# Altium schematic sheet 02_Connectors.SchDoc: Connectors
size A; Revision: A; SheetNumber: 2; SheetTotal: 10; ECE315_Project_Name: ECE453 Processor Mezzanine
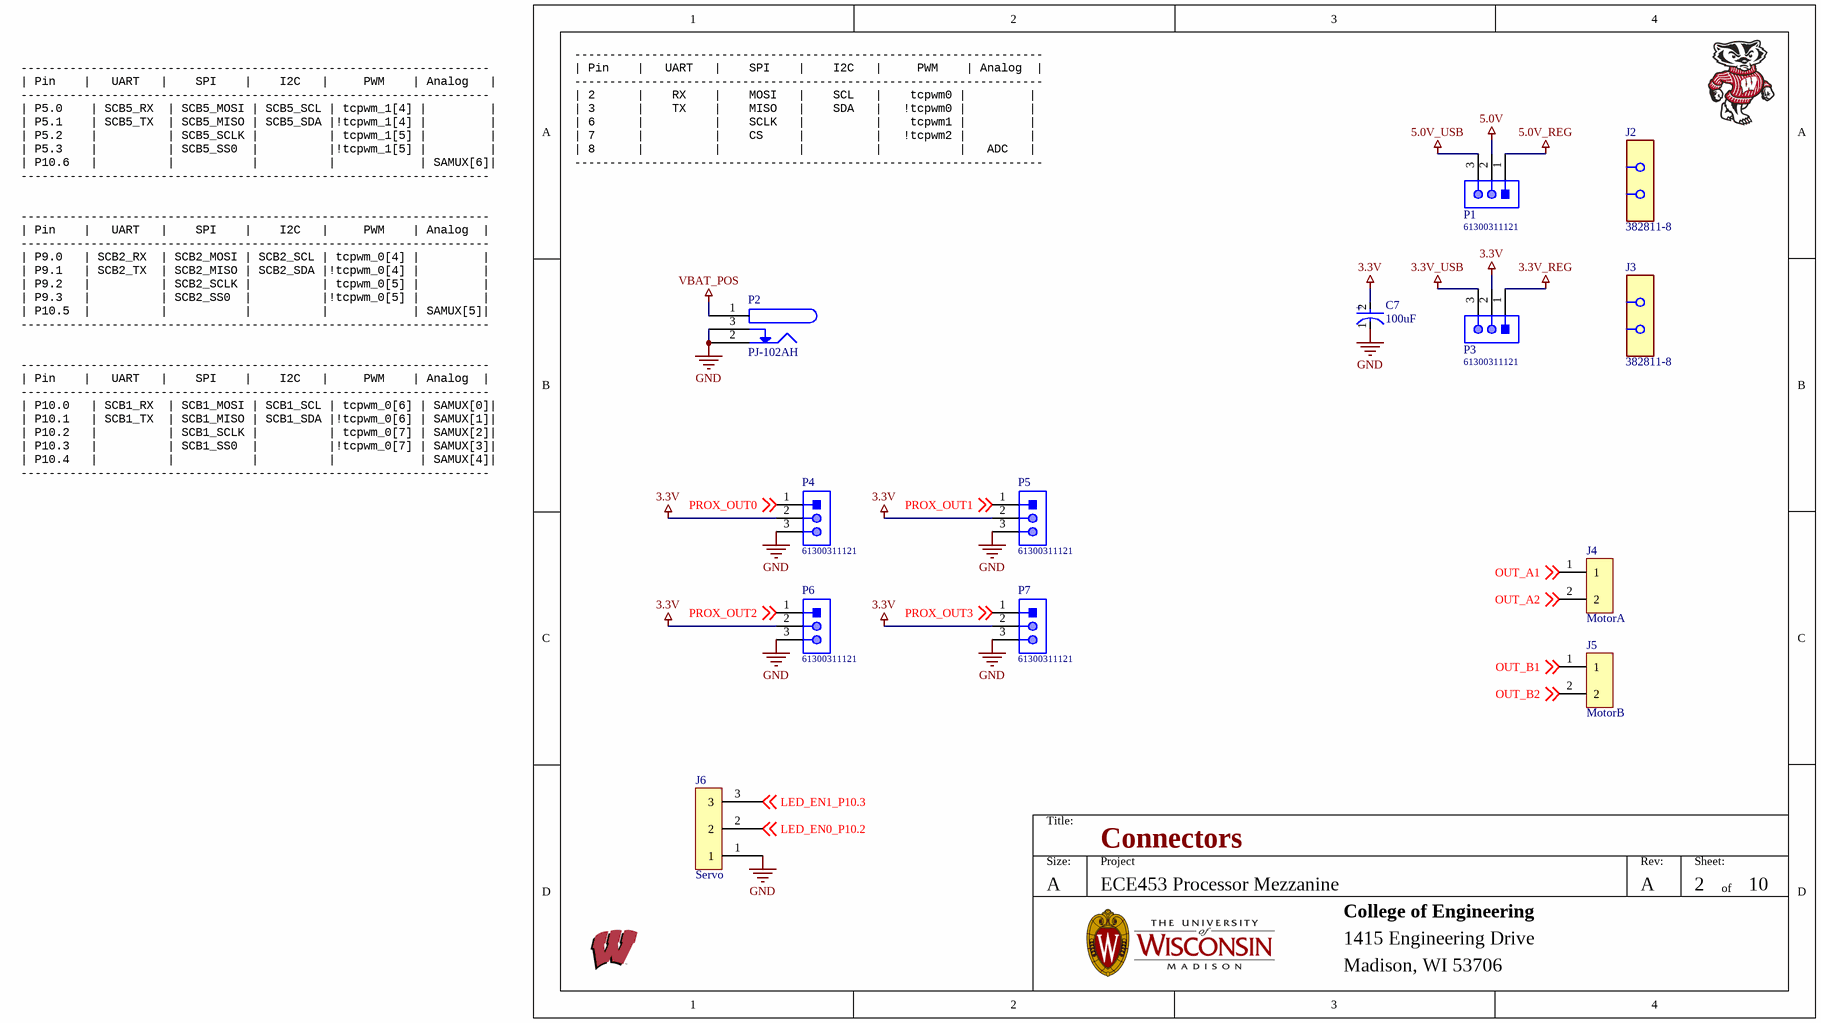
[diagram p0: 02_Connectors.SchDoc]

## Parts
C7  Capacitance: 100uF  [FP-SD8-MFG]  (hidden comment: EEE-1EA101XP)
J2  382811-8  [FP-382811-8-MFG]
J3  382811-8  [FP-382811-8-MFG]
J4  MotorA  [PHOENIX2X0.2]
J5  MotorB  [PHOENIX2X0.2]
J6  Servo  [PHOENIX3X0.2]
P1  61300311121  [61300311121]
P2  Manufacturer Part Number: PJ-102AH  [PJ-102]  (hidden comment: PJ-102)
P3  61300311121  [61300311121]
P4  61300311121  [61300311121]
P5  61300311121  [61300311121]
P6  61300311121  [61300311121]
P7  61300311121  [61300311121]

## Nets
3.3V: C7.2(A) P3.2 P4.2 P5.2 P6.2 P7.2
3.3V_REG: P3.1
3.3V_USB: P3.3
5.0V: P1.2
5.0V_REG: P1.1
5.0V_USB: P1.3
GND: C7.1(C) J6.1 P2.2 P2.3 P4.3 P5.3 P6.3 P7.3
VBAT_POS: P2.1
LED_EN0_P10.2: J6.2 ; off-sheet LED_EN0_P10.2
LED_EN1_P10.3: J6.3 ; off-sheet LED_EN1_P10.3
OUT_A1: J4.1 ; off-sheet OUT_A1
OUT_A2: J4.2 ; off-sheet OUT_A2
OUT_B1: J5.1 ; off-sheet OUT_B1
OUT_B2: J5.2 ; off-sheet OUT_B2
PROX_OUT0: P4.1 ; off-sheet PROX_OUT0
PROX_OUT1: P5.1 ; off-sheet PROX_OUT1
PROX_OUT2: P6.1 ; off-sheet PROX_OUT2
PROX_OUT3: P7.1 ; off-sheet PROX_OUT3

## Notes on the sheet
- -------------------------------------------------------------------
  | Pin    |   UART   |    SPI    |    I2C   |     PWM    | Analog   |
  -------------------------------------------------------------------
  | P5.0    | SCB5_RX  | SCB5_MOSI | SCB5_SCL | tcpwm_1[4] |         |
  | P5.1    | SCB5_TX  | SCB5_MISO | SCB5_SDA |!tcpwm_1[4] |         |
  | P5.2    |          | SCB5_SCLK |          | tcpwm_1[5] |         |
  | P5.3    |          | SCB5_SS0  |          |!tcpwm_1[5] |         |
  | P10.6   |          |           |          |            | SAMUX[6]|
  -------------------------------------------------------------------
- -------------------------------------------------------------------
  | Pin    |   UART   |    SPI    |    I2C   |     PWM    | Analog  |
  -------------------------------------------------------------------
  | 2      |    RX    |    MOSI   |    SCL   |    tcpwm0 |         |
  | 3      |    TX    |    MISO   |    SDA   |   !tcpwm0 |         |
  | 6      |          |    SCLK   |          |    tcpwm1 |         |
  | 7      |          |    CS     |          |   !tcpwm2 |         |
  | 8      |          |           |          |           |   ADC   |
  -------------------------------------------------------------------
- -------------------------------------------------------------------
  | Pin    |   UART   |    SPI    |    I2C   |     PWM    | Analog  |
  -------------------------------------------------------------------
  | P9.0   | SCB2_RX  | SCB2_MOSI | SCB2_SCL | tcpwm_0[4] |         |
  | P9.1   | SCB2_TX  | SCB2_MISO | SCB2_SDA |!tcpwm_0[4] |         |
  | P9.2   |          | SCB2_SCLK |          | tcpwm_0[5] |         |
  | P9.3   |          | SCB2_SS0  |          |!tcpwm_0[5] |         |
  | P10.5  |          |           |          |            | SAMUX[5]|
  -------------------------------------------------------------------
- -------------------------------------------------------------------
  | Pin    |   UART   |    SPI    |    I2C   |     PWM    | Analog  |
  -------------------------------------------------------------------
  | P10.0   | SCB1_RX  | SCB1_MOSI | SCB1_SCL | tcpwm_0[6] | SAMUX[0]|
  | P10.1   | SCB1_TX  | SCB1_MISO | SCB1_SDA |!tcpwm_0[6] | SAMUX[1]|
  | P10.2   |          | SCB1_SCLK |          | tcpwm_0[7] | SAMUX[2]|
  | P10.3   |          | SCB1_SS0  |          |!tcpwm_0[7] | SAMUX[3]|
  | P10.4   |          |           |          |            | SAMUX[4]|
  -------------------------------------------------------------------
- Title:
- Size:
- A
- Project
- Rev:
- Sheet:
- of
- College of Engineering
- 1415 Engineering Drive
- Madison, WI 53706
- (in symbol CMP-05427-000061-1) +

## Library data of the parts
C7 = CMP-05427-000061-1: CAP ALUM 100UF 20% 25V SMD; Manufacturer: Panasonic; Leakage Current: 3uA; Life (Hours): 2000Hour; Ripple Current: 143mA; Polarity: Polar; Height - Seated (Max): 0.303inch; Contact Plating: Tin; Max Operating Temperature: 85°C; Package Quantity: 900; RoHS Compliant: Yes; Termination: SMD/SMT; Lead Free: Lead Free; Min Operating Temperature: -40°C; Radiation Hardening: No; Length: 8mm; Height: 7.7mm; Series: S; Voltage Rating: 25V; Diameter: 6.3mm; Ripple Current (AC): 143mA; Case/Package: Radial; Packaging: Tape and Reel; Voltage: 25V; Tolerance: 20%; Construction: Cylindrical; Voltage Rating (DC): 25V; Mount: Surface Mount; Supplier: Newark; Supplier Part Number: 47AC4798; Manufacturer Part Number: EEE-1EA101XP; RoHS: Yes; Category: Aluminum Electrolytic Capacitors; Stock: 12600; Pricing: 1=0.166, 900=0.162, 1800=0.158 (USD); Mounting Technology: Surface Mount,PCB; Value: 100uF; Ratings: AEC-Q200; Reach SVHC Compliant: Unknown; ComponentLink1URL: https://media.digikey.com/pdf/Data%20Sheets/Panasonic%20Electronic%20Components/S_Series,Type_V_Rev2018.pdf?src-supplier=Digi-Key; ComponentLink1Description: https://media.digikey.com/pdf/Data%20Sheets/Panasonic%20Electronic%20Components/S_Series,Type_V_Rev2018.pdf?src-supplier=Digi-Key; ComponentLink2URL: https://industrial.panasonic.com/cdbs/www-data/pdf/RDE0000/DME0000COL90.pdf?src-supplier=Digi-Key; ComponentLink2Description: https://industrial.panasonic.com/cdbs/www-data/pdf/RDE0000/DME0000COL90.pdf?src-supplier=Digi-Key; ComponentLink3URL: https://industrial.panasonic.com/cdbs/www-data/pdf/RDE0000/DME0000COL90.pdf?src-supplier=Arrow+Electronics; ComponentLink3Description: https://industrial.panasonic.com/cdbs/www-data/pdf/RDE0000/DME0000COL90.pdf?src-supplier=Arrow+Electronics
J2 J3 = CMP-03355-000020-1: CONN SHUNT 2POS OPEN 2.54MM; Manufacturer 1: TE Connectivity; Number of Positions: 2; Current Rating: 3A; Approvals: UL; Plating Thickness: 0.127um; Insulation Resistance: 1GR; Max Operating Temperature: 105°C; Housing Material: Polyester; Flammability Rating: UL94 V-0; Package Quantity: 1500; Contact Current Rating: 3A; Pitch: 2.54mm; Height: 6.35mm; Lead Free: Lead Free; Contact Gender: Female; Length: 5.08mm; Color: Black; Housing Color: Black; Min Operating Temperature: -65°C; Series: AMPMODU; Depth: 2.54mm; Number of Rows: 1; Orientation: Straight; Number of Contacts: 2; Contact Plating: Gold; ELV: Compliant; Radiation Hardening: No; Contact Material: Bronze; Packaging: Box; Supplier 1: Digi-Key; Supplier Part Number 1: A26228-ND; Manufacturer Part Number 1: 382811-8; RoHS: Yes; Category: Board to Board Connectors; Stock 1: 342640; Pricing 1: 10=0.192, 30=0.17833, 50=0.169, 100=0.1599, 250=0.14884, 500=0.14026, 1000=0.1329, 2500=0.1231, 5000=0.11147 (USD); Reach SVHC Compliant: Unknown; RoHS Compliant: Yes; ComponentLink1URL: https://datasheet.ciiva.com/25616/0900766b810caf26-25616808.pdf?src-supplier=Rs; ComponentLink1Description: https://datasheet.ciiva.com/25616/0900766b810caf26-25616808.pdf?src-supplier=Rs; ComponentLink2URL: https://datasheet.ciiva.com/767/eng-cd-382811-l-767846.pdf?src-supplier=Digi-Key; ComponentLink2Description: https://datasheet.ciiva.com/767/eng-cd-382811-l-767846.pdf?src-supplier=Digi-Key; ComponentLink3URL: https://datasheet.ciiva.com/30253/eng-cs-1307819-section-6-7and8-0808-30253247.pdf?src-supplier=Onlinecomponents.com; ComponentLink3Description: https://datasheet.ciiva.com/30253/eng-cs-1307819-section-6-7and8-0808-30253247.pdf?src-supplier=Onlinecomponents.com; ComponentLink4URL: https://datasheet.ciiva.com/14640/70083050-14640423.pdf?src-supplier=Allied+Electronics; ComponentLink4Description: https://datasheet.ciiva.com/14640/70083050-14640423.pdf?src-supplier=Allied+Electronics; ComponentLink5URL: https://datasheet.ciiva.com/1412/eng-cs-1307819-section-6-7and8-0808-1412631.pdf?src-supplier=Element14; ComponentLink5Description: https://datasheet.ciiva.com/1412/eng-cs-1307819-section-6-7and8-0808-1412631.pdf?src-supplier=Element14; ComponentLink6URL: https://datasheet.ciiva.com/3120/eng-cs-1307819-section-6-7and8-0808-3120187.pdf?src-supplier=Avnet; ComponentLink6Description: https://datasheet.ciiva.com/3120/eng-cs-1307819-section-6-7and8-0808-3120187.pdf?src-supplier=Avnet; Supplier: Newark; Supplier Part Number: 52F5498; Manufacturer: TE Connectivity; Manufacturer Part Number: 382811-8; Stock: 6205; Pricing: 1=0.255, 10=0.171, 25=0.156, 100=0.14, 500=0.131, 1000=0.105 (USD)
J4 J5 = 2-Pin: 2~24 Poles, Screw Type, Horizontal, 5.08 Pitch, 26~14 (AWG), Terminal Block Connector; Manufacturer: CUI Devices; Manufacturer Part Number: TB006-508-02BE; ComponentLink1URL: https://datasheet.ciiva.com/709/eng-cd-640456-w1-709680.pdf?src-supplier=Digi-Key; ComponentLink1Description: https://datasheet.ciiva.com/709/eng-cd-640456-w1-709680.pdf?src-supplier=Digi-Key; ComponentLink2URL: https://datasheet.ciiva.com/3118/eng-ds-82056-mta-0608-3118497.pdf?src-supplier=Avnet; ComponentLink2Description: https://datasheet.ciiva.com/3118/eng-ds-82056-mta-0608-3118497.pdf?src-supplier=Avnet; ComponentLink3URL: https://datasheet.ciiva.com/16401/eng-ds-82056-mta-0608-16401289.pdf?src-supplier=Future+Electronics; ComponentLink3Description: https://datasheet.ciiva.com/16401/eng-ds-82056-mta-0608-16401289.pdf?src-supplier=Future+Electronics; ComponentLink4URL: https://datasheet.ciiva.com/25617/0900766b80027008-25617244.pdf?src-supplier=RSComponents; ComponentLink4Description: https://datasheet.ciiva.com/25617/0900766b80027008-25617244.pdf?src-supplier=RSComponents; ComponentLink5URL: https://datasheet.ciiva.com/14156/04384301-14156820.pdf?src-supplier=Distrelec; ComponentLink5Description: https://datasheet.ciiva.com/14156/04384301-14156820.pdf?src-supplier=Distrelec; ComponentLink6URL: https://datasheet.ciiva.com/11746/0900766b80eb7fdd-11746365.pdf?src-supplier=RSComponents; ComponentLink6Description: https://datasheet.ciiva.com/11746/0900766b80eb7fdd-11746365.pdf?src-supplier=RSComponents; ComponentLink7URL: https://datasheet.ciiva.com/7128/1866390-7128742.pdf?src-supplier=Newark; ComponentLink7Description: https://datasheet.ciiva.com/7128/1866390-7128742.pdf?src-supplier=Newark; ComponentLink8URL: https://datasheet.ciiva.com/16505/eng-ds-82056-mta-0608-16505419.pdf?src-supplier=Avnet+Asia; ComponentLink8Description: https://datasheet.ciiva.com/16505/eng-ds-82056-mta-0608-16505419.pdf?src-supplier=Avnet+Asia; Supplier: Digi-Key; RoHS: Yes; Category: Terminal Blocks; Stock 1: 50889; Pricing 1: 1=0.86, 10=0.472, 25=0.3524, 50=0.3142, 100=0.308, 250=0.27108, 500=0.24644, 1000=0.2218, 5000=0.16635 (USD); Supplier Part Number: 102-6191-ND
J6 = 3-Pin_2: 2~24 Poles, Screw Type, Horizontal, 5.08 Pitch, 26~14 (AWG), Terminal Block Connector; Manufacturer: CUI Devices; Manufacturer Part Number: TB006-508-03BE; Supplier 1: Digi-Key; Supplier Part Number 1: 102-6192-ND; RoHS: Yes; Category: Terminal Blocks; Stock 1: 41909; Pricing 1: 1=0.91, 10=0.567, 25=0.4856, 50=0.4364, 100=0.4272, 250=0.3636, 500=0.34542, 1000=0.30906, 5000=0.24179 (USD)
P1 P3-P7 = CMP-1502-01062-1: THT Vertical Pin Header WR-PHD, Pitch 2.54 mm, Single Row, 3 pins; Manufacturer: Wurth Elektronik; Manufacturer 1: Wurth Electronics; Withstanding Voltage: 500VAC; Working Voltage: 250VAC; Rated Current: 3A; Pitch: 2.54mm; Pin Number: 3; Gender: Male; Contact Resistance: 20mOhm; Package Reference: 61300311121; Manufacturer URL: http://www.we-online.de; Datasheet URL: https://katalog.we-online.de/em/datasheet/6130xx11121.pdf; Operating Temperature: -40to105degC; Part Number: 61300311121; Orientation: Vertical; Packaging: Bag; Row Number: Single; Mounting Technology: THT; Publisher: WurthElektronik; Supplier 1: Digi-Key; Supplier Part Number 1: 732-5316-ND; Manufacturer Part Number 1: 61300311121; RoHS: Yes; Category: Connectors; Stock 1: 225106; Pricing 1: 1=0.13, 10=0.113, 25=0.094, 50=0.079, 100=0.071, 1000=0.066 (USD); Mount: Through Hole; Contact Plating: Gold; Contact Material: Copper; Color: Black; Number of Rows: 1; Number of Positions: 3; Termination: Solder; Number of Contacts: 3; Series: WR-PHD; Contact Type: Male Pin; Contact Mating Length: 0.236inch; Lead Free: Lead Free; RoHS Compliant: Yes; Reach SVHC Compliant: Unknown; ComponentLink1URL: http://www.farnell.com/cad/1737268.pdf?src-supplier=Element14; ComponentLink1Description: http://www.farnell.com/cad/1737268.pdf?src-supplier=Element14; ComponentLink2URL: https://katalog.we-online.de/em/datasheet/6130xx11121.pdf?src-supplier=Digi-Key; ComponentLink2Description: https://katalog.we-online.de/em/datasheet/6130xx11121.pdf?src-supplier=Digi-Key; Supplier: Newark; Supplier Part Number: 20X0950; Manufacturer Part Number: 61300311121; Stock: 65141; Pricing: 1=0.133, 10=0.115, 25=0.096, 50=0.081, 100=0.072 (USD); ComponentLink3URL: https://datasheet.octopart.com/61300311121-W%C3%BCrth-Elektronik-datasheet-21154836.pdf?src-supplier=Element14; ComponentLink3Description: https://datasheet.octopart.com/61300311121-W%C3%BCrth-Elektronik-datasheet-21154836.pdf?src-supplier=Element14
P2 = CONN JACK PWR W/SW: CONN PWR JACK 2.1X5.5MM HIGH CUR; Manufacturer: CUI Inc; Internal Switch(s): Single Switch, Normally Closed; Number of Positions/Contacts: 2 Conductors, 3 Contacts; Plug/Mating Plug Diameter: 2.1mm ID, 5.5mm OD; Gender: Male; Shielding: Unshielded; Voltage - Rated: 24VDC; Current Rating: 5A; Value: CP-102AD; Mounting Type: Through Hole, Right Angle; Supplier: Digi-Key; Connector Type: Jack; Supplier Part Number: CP-102AH-ND; Termination: Solder; Contact Material: Copper; Housing Material: Thermoplastic; Contact Material - Plating: Nickel; Housing Color: Black; Operating Temperature: -25°C ~ 85°C; Color: Black